# Altium schematic sheet Power_management.SchDoc
size A4
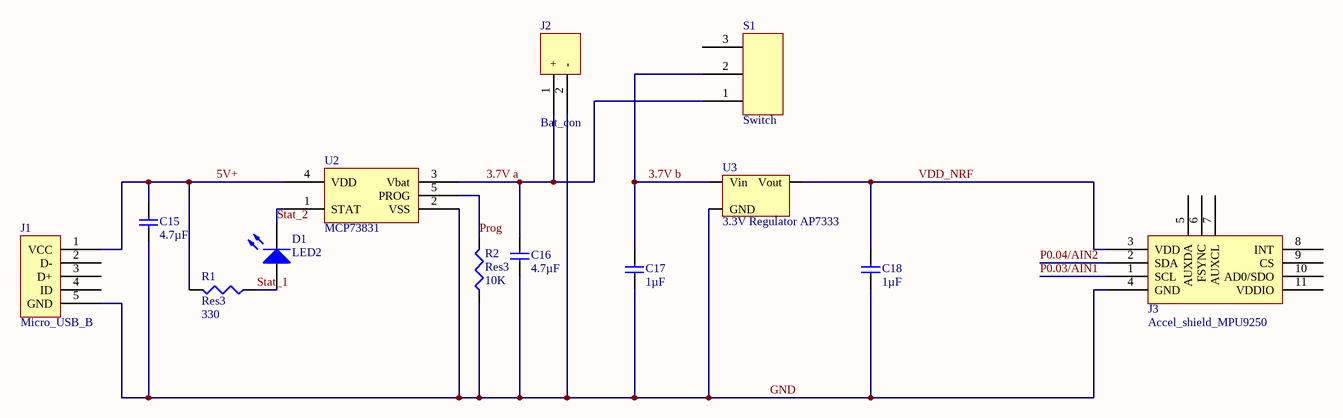
[diagram p0: Power_management.SchDoc]

## Parts
C15  4.7µF  [CAPC1608X06L]
C16  4.7µF  [CAPC1608X06L]
C17  1µF  [CAPC1608X06L]
C18  1µF  [CAPC1608X06L]
D1  LED2  [LED_0603_G]
J1  Micro_USB_B  [Micro_USB_AB]
J2  Bat_con  [Bat_con]
J3  Accel_shield_MPU9250  [Accel_shield]
R1  Res3  value 330  [J1-0603]
R2  Res3  value 10K  [J1-0603]
S1  Switch  [Switch]
U2  MCP73831  [SOT23-5]
U3  3.3V Regulator AP7333  [SOT-23A]

## Nets
3.7V a: C16.2 J2.1(+) S1.1 U2.3(Vbat)
3.7V b: C17.2 S1.2 U3.1(Vin)
5V+: C15.2 J1.1(VCC) R1.2 U2.4(VDD)
GND: C15.1 C16.1 C17.1 C18.1 J1.5(GND) J2.2(-) J3.4(GND) R2.1 U2.2(VSS) U3.3(GND)
P0.03/AIN1: J3.1(SCL)
P0.04/AIN2: J3.2(SDA)
Prog: R2.2 U2.5(PROG)
Stat_1: D1.1(A) R1.1
Stat_2: D1.2(K) U2.1(STAT)
VDD_NRF: C18.2 J3.3(VDD) U3.2(Vout)

Not connected (* = marked no-connect by the designer): J1 2(D-) 3(D+) 4(ID); J3 5(AUXDA) 6(FSYNC) 7(AUXCL) 8(INT) 9(CS) 10(AD0/SDO) 11(VDDIO); S1 3

## Library data of the parts
C15-C18 = CAP_0603: Capacitor, X5R, ±10%; Part Number: C0603-4µ7; Note: 6.3V; Artikkelnr Noca: 20069060; Artikkelnr Simpro: N.A.; Manufacturer: *; Manufacturer Part Number: *; Datasheet: *; LatestRevisionDate: 2009-11-23; Pin Count: 2; Publisher: Nordic Semiconductor; Published: 2009-05-08; Supplier: *; Supplier part number: *; 2nd source Supplier: *; 2nd source part number: *; Footprint Doc: 0603
  C15 C16: Value: 4.7µF
  C17 C18: Value: 1µF
D1 = LED2: Typical RED, GREEN, YELLOW, AMBER GaAs LED; Published: 8-Jun-2000; LatestRevisionDate: 17-Jul-2002; LatestRevisionNote: Re-released for DXP Platform.; PackageVersion: Feb-2002; PackageReference: 3.2X1.6X1.1; Publisher: Altium Limited; PackageDescription: SM LED; 2 Flat Leads
R1 R2 = Res3: Resistor; Published: 8-Jun-2000; LatestRevisionDate: 29-May-2009; LatestRevisionNote: IPC-7351 Footprint Added.; PackageReference: J1-0603; Publisher: Altium Limited; PackageDescription: Chip Resistor
U3 = AP7333-XXSAG: 300mA, Low Quiescent Current, Fast Transient Low Dropout Linear Regulator; Part Number: AP7333-33SAG-7; Manufacturer: Diodes Incorporated; Value: AP7333-33SAG-7; Artikkelnr Noca: 17039216; Artikkelnr Simpro: N.A.; Manufacturer Part Number: AP7333-33SAG-7; Datasheet: http://www.diodes.com/datasheets/AP7333.pdf; LatestRevisionDate: 2012-06-15; Pin Count: 3; Publisher: Nordic Semiconductor; Published: 2012-06-15; Note: *; Supplier: Digi-Key; Supplier part number: AP7333-33SAG-7DICT-ND; 2nd source Supplier: *; 2nd source part number: *; Footprint Doc: SOT-23-3